# Altium schematic sheet SCH_DHT11.SchDoc
size A3; SheetNumber: 10; SheetTotal: 10
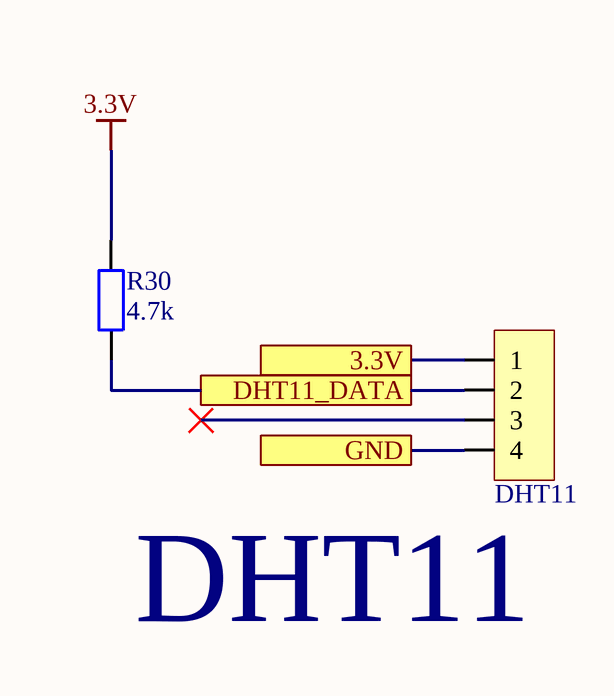
[diagram p0: SCH_DHT11.SchDoc]

## Parts
JP3  DHT11  [JP 1x4 CT]
R30  4.7k  [tro smd 0805]

## Ports
3.3V, DHT11_DATA, GND

## Nets
3.3V: R30.2
3.3V: JP3.1 ; port 3.3V  [a separate net that carries the same name]
DHT11_DATA: JP3.2 R30.1 ; port DHT11_DATA
GND: JP3.4 ; port GND

Not connected (* = marked no-connect by the designer): JP3 3*

## Notes on the sheet
- (near JP3) DHT11

## Library data of the parts
JP3 = JP 1x4 2.54 Cai Thang: Cắm; Ten_Linh_Kien: Jump Đơn Cái 2.54MM 1x20P Thẳng; Don_Vi: Con; Ma_Hang: MH004006; Ghi_Chu: *; Kieu_Chan: *; Chung_Loai: Cắm
R30 = Tro 0805 5% 4.7k: Dán; Don_Vi: Con; So_Chan: 2; Ten_Linh_Kien: Trở 0805 5% 4.7k; Ma_Hang: MH005307; Chung_Loai: Dán; Kieu_Chan: *